# Altium schematic sheet Max31855.SchDoc
size A4
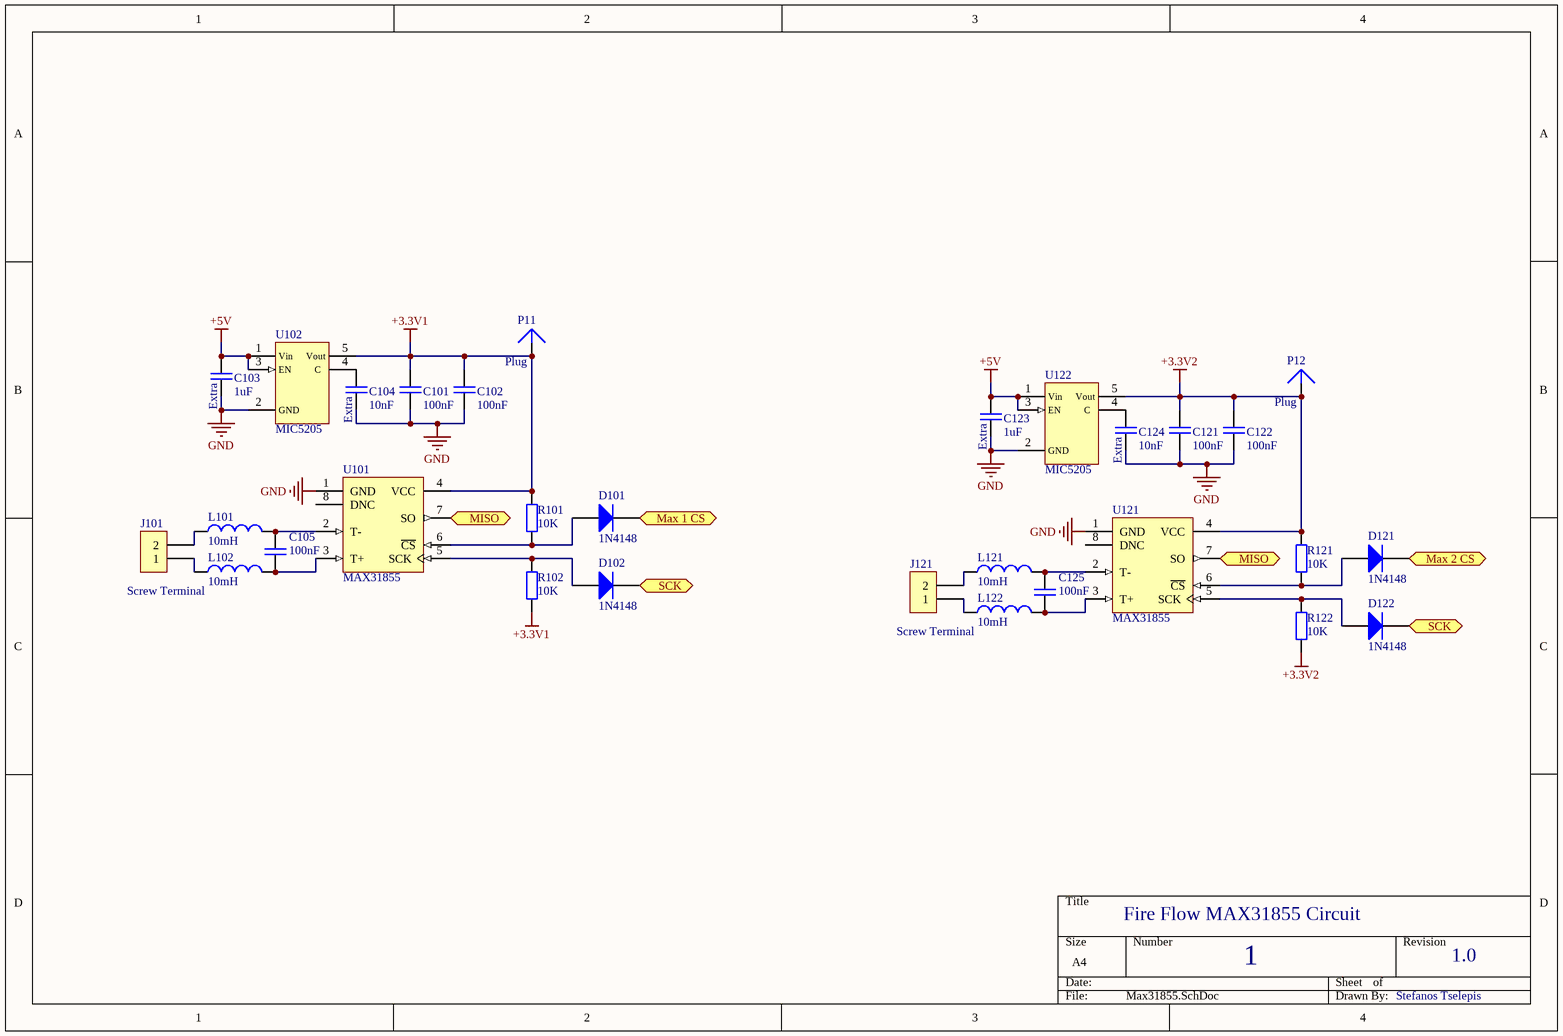
[diagram p0: Max31855.SchDoc]

## Parts
C101  100nF  [CC2013-0805]
C102  100nF  [CC2013-0805]
C103  1uF  [CC2013-0805]
C104  10nF  [CC2013-0805]
C105  100nF  [CC2013-0805]
C121  100nF  [CC2013-0805]
C122  100nF  [CC2013-0805]
C123  1uF  [CC2013-0805]
C124  10nF  [CC2013-0805]
C125  100nF  [CC2013-0805]
D101  1N4148  [CD2012-0805]
D102  1N4148  [CD2012-0805]
D121  1N4148  [CD2012-0805]
D122  1N4148  [CD2012-0805]
J101  Screw Terminal  [2pin ST]
J121  Screw Terminal  [2pin ST]
L101  10mH  [INDC2012-0805]
L102  10mH  [INDC2012-0805]
L121  10mH  [INDC2012-0805]
L122  10mH  [INDC2012-0805]
P11  Plug  [PIN1]
P12  Plug  [PIN1]
R101  10K  [CR2012-0805]
R102  10K  [CR2012-0805]
R121  10K  [CR2012-0805]
R122  10K  [CR2012-0805]
U101  MAX31855  [S8]
U102  MIC5205  [SO-G5/P.95]
U121  MAX31855  [S8]
U122  MIC5205  [SO-G5/P.95]

## Ports
Max 1 CS (in), Max 2 CS (in), MISO (out), SCK (in)

## Nets
+3.3V1: C101.1 C102.1 P11.1 R101.2 R102.1 U101.4(VCC) U102.5(Vout)
+3.3V2: C121.1 C122.1 P12.1 R121.2 R122.1 U121.4(VCC) U122.5(Vout)
+5V: C103.1 C123.1 U102.1(Vin) U102.3(EN) U122.1(Vin) U122.3(EN)
GND: C101.2 C102.2 C103.2 C104.2 C121.2 C122.2 C123.2 C124.2 U101.1(GND) U102.2(GND) U121.1(GND) U122.2(GND)
Max 1 CS: D101.K ; port Max 1 CS
Max 2 CS: D121.K ; port Max 2 CS
MISO: U101.7(SO) U121.7(SO) ; port MISO
SCK: D102.K D122.K ; port SCK
NetC104_1: C104.1 U102.4(C)
NetC105_1: C105.1 L101.2 U101.2(T-)
NetC105_2: C105.2 L102.2 U101.3(T+)
NetC124_1: C124.1 U122.4(C)
NetC125_1: C125.1 L121.2 U121.2(T-)
NetC125_2: C125.2 L122.2 U121.3(T+)
NetD101_A: D101.A R101.1 U101.6(~{CS})
NetD102_A: D102.A R102.2 U101.5(SCK)
NetD121_A: D121.A R121.1 U121.6(~{CS})
NetD122_A: D122.A R122.2 U121.5(SCK)
NetJ101_1: J101.1 L102.1
NetJ101_2: J101.2 L101.1
NetJ121_1: J121.1 L122.1
NetJ121_2: J121.2 L121.1

Not connected (* = marked no-connect by the designer): U101 8(DNC); U121 8(DNC)

## Notes on the sheet
- (near C103) Extra
- (near C104) Extra
- (near C123) Extra
- (near C124) Extra
- Fire Flow MAX31855 Circuit
- 1
- 1.0
- Stefanos Tselepis

## Library data of the parts
C101-C105 C121-C125 = Cap Metal Film
  C101 C102 C105 C121 C122 C125: Value: 100nF
  C103 C123: Value: 1uF
  C104 C124: Value: 10nF
D101 D102 D121 D122 = Diode: Value: 1N4148
J101 J121 = 2 pin Screw Terminal: WR-TBL Terminal block - serie 102 - 5.0mm; ComponentLink2 Description: Datasheet; NoPins: 2; ComponentLink2URL: http://katalog.we-online.de/em/datasheet/6911027100xx.pdf
L101 L102 L121 L122 = Inductor: Value: 10mH
R101 R102 R121 R122 = Resistor: Value: 10K
U101 U121 = MAX31855: Cold Junction Compensated Thermocouple to Digital Converter, 14 Bits Temperature Resolution, -40 to 125 degC, 8-Pin SOIC (S8+4), Pb-Free, Tape ang Reel; Functions: Thermocouple-to-Digital Converter; Interface: SPI; PackageReference: S8+4; PackageDescription: 8-Pin Small-Outline IC, Narrow, Body 3.9 x 4.9 mm, Pitch 1.27 mm; Generic Part Number: MAX31855; Mounting Technology: Surface Mount
P11 P12 = Plug: LatestRevisionDate: 17-Jul-2002; LatestRevisionNote: Re-released for DXP Platform.; Publisher: Altium Limited